# Altium schematic sheet Sheet1.SchDoc
size A4
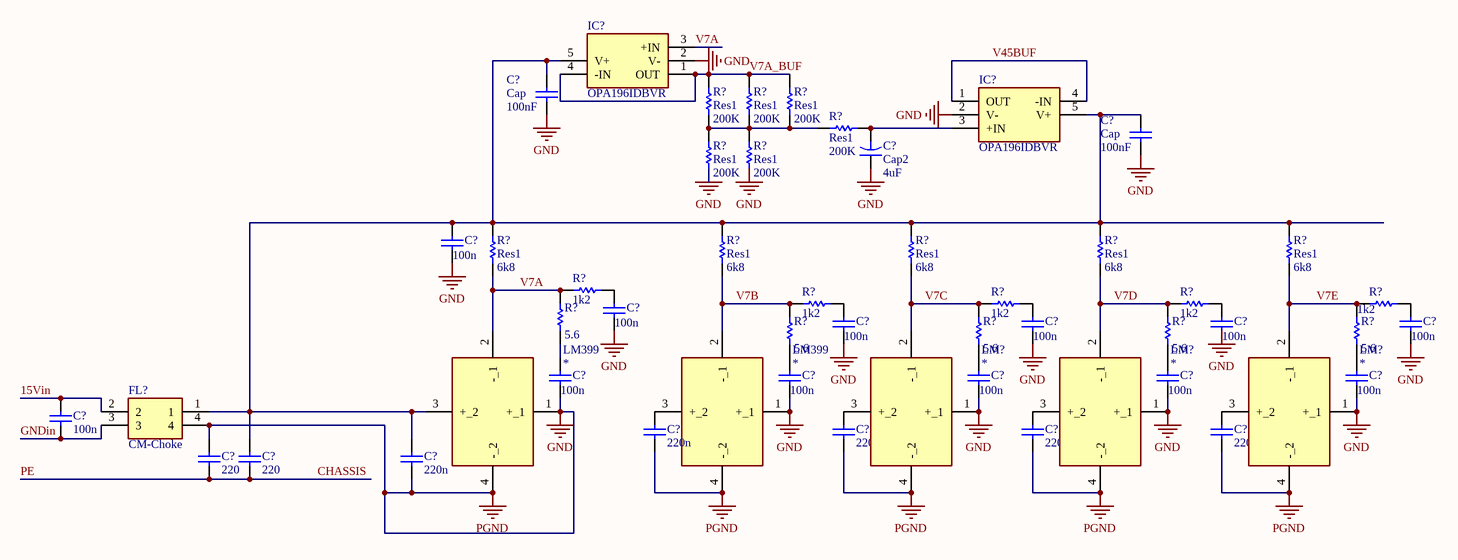
[diagram p0: Sheet1.SchDoc]

## Parts
(Parts that share a designator on the sheet are numbered #1, #2 ... from top to bottom, then left to right.)
C?#1  Cap  value 100nF  [RAD-0.3]
C?#2  Cap  value 100nF  [RAD-0.3]
C?#3  Cap2  value 4uF  [CAPR5-4X5]
C?#4  value 100n  [RAD-0.3]
C?#5  value 100n  [RAD-0.3]
C?#6  value 100n  [RAD-0.3]
C?#7  value 100n  [RAD-0.3]
C?#8  value 100n  [RAD-0.3]
C?#9  value 100n  [RAD-0.3]
C?#10  value 100n  [RAD-0.3]
C?#11  value 100n  [RAD-0.3]
C?#12  value 100n  [RAD-0.3]
C?#13  value 100n  [RAD-0.3]
C?#14  value 100n  [RAD-0.3]
C?#15  100n  [RAD-0.3]
C?#16  220n  [RAD-0.3]
C?#17  220n  [RAD-0.3]
C?#18  220n  [RAD-0.3]
C?#19  220n  [RAD-0.3]
C?#20  220  [RAD-0.3]
C?#21  220  [RAD-0.3]
C?#22  220n  [RAD-0.3]
FL?  CM-Choke  [0603USB251MLB]
IC?#1  OPA196IDBVR  [SOT95P280X145-5N]
IC?#2  OPA196IDBVR  [SOT95P280X145-5N]
LM399#1  *  [LM399AHPBF]
LM399#2  *  [LM399AHPBF]
LM?#1  *  [LM399AHPBF]
LM?#2  *  [LM399AHPBF]
LM?#3  *  [LM399AHPBF]
R?#1  Res1  value 200K  [AXIAL-0.3]
R?#2  Res1  value 200K  [AXIAL-0.3]
R?#3  Res1  value 200K  [AXIAL-0.3]
R?#4  Res1  value 200K  [AXIAL-0.3]
R?#5  Res1  value 200K  [AXIAL-0.3]
R?#6  Res1  value 200K  [AXIAL-0.3]
R?#7  Res1  value 6k8  [AXIAL-0.3]
R?#8  Res1  value 6k8  [AXIAL-0.3]
R?#9  Res1  value 6k8  [AXIAL-0.3]
R?#10  Res1  value 6k8  [AXIAL-0.3]
R?#11  Res1  value 6k8  [AXIAL-0.3]
R?#12  value 1k2  [AXIAL-0.3]
R?#13  value 1k2  [AXIAL-0.3]
R?#14  value 1k2  [AXIAL-0.3]
R?#15  value 1k2  [AXIAL-0.3]
R?#16  value 1k2  [AXIAL-0.3]
R?#17  value 5.6  [AXIAL-0.3]
R?#18  value 5.6  [AXIAL-0.3]
R?#19  value 5.6  [AXIAL-0.3]
R?#20  value 5.6  [AXIAL-0.3]
R?#21  value 5.6  [AXIAL-0.3]

## Nets
GND: C?#1.2 C?#2.2 C?#3.1 C?#4.1 C?#5.1 C?#6.1 C?#7.1 C?#9.1 C?#10.1 C?#11.1 C?#12.1 C?#13.1 C?#14.1 C?#16.1 C?#17.1 C?#18.1 C?#19.1 C?#20.2 C?#22.1 FL?.4 IC?#1.2(V-) IC?#2.2(V-) LM399#1.1(+_1) LM399#1.4(-_2) LM399#2.1(+_1) LM399#2.4(-_2) LM?#1.1(+_1) LM?#1.4(-_2) LM?#2.1(+_1) LM?#2.4(-_2) LM?#3.1(+_1) LM?#3.4(-_2) R?#5.1  [also labelled PGND]
15Vin: C?#15.1 FL?.2
CHASSIS: C?#20.1 C?#21.1  [also labelled PE]
GNDin: C?#15.2 FL?.3
V7A: IC?#1.3(+IN) LM399#1.2(-_1) R?#7.1 R?#12.2 R?#17.2
V7A_BUF: IC?#1.1(OUT) IC?#1.4(-IN) R?#1.2 R?#2.2 R?#3.2
V7B: LM399#2.2(-_1) R?#8.1 R?#13.2 R?#18.2
V7C: LM?#1.2(-_1) R?#9.1 R?#14.2 R?#19.2
V7D: LM?#2.2(-_1) R?#10.1 R?#15.2 R?#20.2
V7E: LM?#3.2(-_1) R?#11.1 R?#16.2 R?#21.2
V45BUF: IC?#2.1(OUT) IC?#2.4(-IN)
NetC?#1_1: C?#1.1 C?#2.1 C?#4.2 C?#21.2 C?#22.2 FL?.1 IC?#1.5(V+) IC?#2.5(V+) LM399#1.3(+_2) R?#7.2 R?#8.2 R?#9.2 R?#10.2 R?#11.2
NetC?#3_2: C?#3.2 IC?#2.3(+IN) R?#4.2
NetC?#5_2: C?#5.2 R?#12.1
NetC?#6_2: C?#6.2 R?#13.1
NetC?#7_2: C?#7.2 R?#14.1
NetC?#8_2: C?#8.2 R?#15.1
NetC?#9_2: C?#9.2 R?#16.1
NetC?#10_2: C?#10.2 R?#17.1
NetC?#11_2: C?#11.2 R?#18.1
NetC?#12_2: C?#12.2 R?#19.1
NetC?#13_2: C?#13.2 R?#20.1
NetC?#14_2: C?#14.2 R?#21.1
NetC?#16_2: C?#16.2 LM399#2.3(+_2)
NetC?#17_2: C?#17.2 LM?#1.3(+_2)
NetC?#18_2: C?#18.2 LM?#2.3(+_2)
NetC?#19_2: C?#19.2 LM?#3.3(+_2)
NetR?#1_1: R?#1.1 R?#2.1 R?#3.1 R?#4.1 R?#5.2 R?#6.2

Not connected (* = marked no-connect by the designer): C?#8 1; R?#6 1

## Notes on the sheet
- Labels drawn without touching a wire or pin: GND

## Library data of the parts
C?#1 C?#2 C?#4-C?#22 = Cap: Capacitor; Published: 8-Jun-2000; LatestRevisionDate: 17-Jul-2002; LatestRevisionNote: Re-released for DXP Platform.; PackageReference: RAD-0.3; Publisher: Altium Limited; PackageDescription: Radial Cap, Thru-Hole; 2 Leads; 0.3 in Pin Spacing
C?#3 = Cap2: Capacitor; Published: 23-Sep-2002; PackageReference: CAPR5-4X5; Publisher: Altium Limited; PackageDescription: Capacitor; 2 Leads
FL? = 0603USB-222MLC: Filter; Manufacturer_Name: COILCRAFT; Datasheet Link: https://www.coilcraft.com/pdfs/0603usb.pdf; Height: 1.17mm; Manufacturer_Part_Number: 0603USB-222MLC; Mouser Part Number: 994-0603USB-222MLC; Mouser Price/Stock: https://www.mouser.co.uk/ProductDetail/Coilcraft/0603USB-222MLC?qs=ZYnrCdKdyefEVVuAN1JX1g%3D%3D
IC?#1 IC?#2 = OPA196IDBVR: Integrated Circuit; Manufacturer_Name: Texas Instruments; Datasheet Link: http://www.ti.com/lit/gpn/opa196; Height: 1.45mm; Manufacturer_Part_Number: OPA196IDBVR; Mouser Part Number: 595-OPA196IDBVR; Mouser Price/Stock: https://www.mouser.co.uk/ProductDetail/Texas-Instruments/OPA196IDBVR/?qs=EU6FO9ffTwdOeFWwHLQKWg%3D%3D; Arrow Part Number: OPA196IDBVR; Arrow Price/Stock: https://www.arrow.com/en/products/opa196idbvr/texas-instruments
LM399#1 LM399#2 LM?#1-LM?#3 = LM399AH#PBF: Integrated Circuit; Manufacturer_Name: Analog Devices; Datasheet Link: https://www.analog.com/media/en/technical-documentation/data-sheets/199399fc.pdf; Height: 2.667mm; Manufacturer_Part_Number: LM399AH#PBF; Mouser Part Number: 584-LM399AH#PBF; Mouser Price/Stock: https://www.mouser.co.uk/ProductDetail/Analog-Devices/LM399AHPBF?qs=ytflclh7QUUM8sawX7U9qQ%3D%3D; Arrow Part Number: LM399AH#PBF; Arrow Price/Stock: https://www.arrow.com/en/products/lm399ahpbf/analog-devices
R?#1-R?#21 = Res1: Resistor; Published: 8-Jun-2000; LatestRevisionDate: 17-Jul-2002; LatestRevisionNote: Re-released for DXP Platform.; PackageReference: AXIAL-0.3; Publisher: Altium Limited; PackageDescription: Axial Device, Thru-Hole; 2 Leads; 0.3 in Pin Spacing